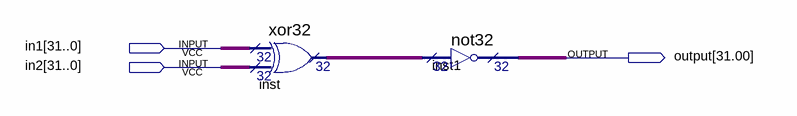
[diagram p0: schematic sheet]
// Quartus schematic xnor.bdf as structural Verilog: 2 symbols, 3 pins
module \xnor  (
  input  [31:0] in1,
  input  [31:0] in2,
  output \output[31.00] 
);

  wire [31:0] inst1_result, inst_result;

  xor32 inst (.data0x(in1), .data1x(in2), .result(inst_result));
  not32 inst1 (.data(inst_result), .result(inst1_result));
endmodule
